# EAGLE design SNES_RGB_in_pass (EAGLE 7.5.0)
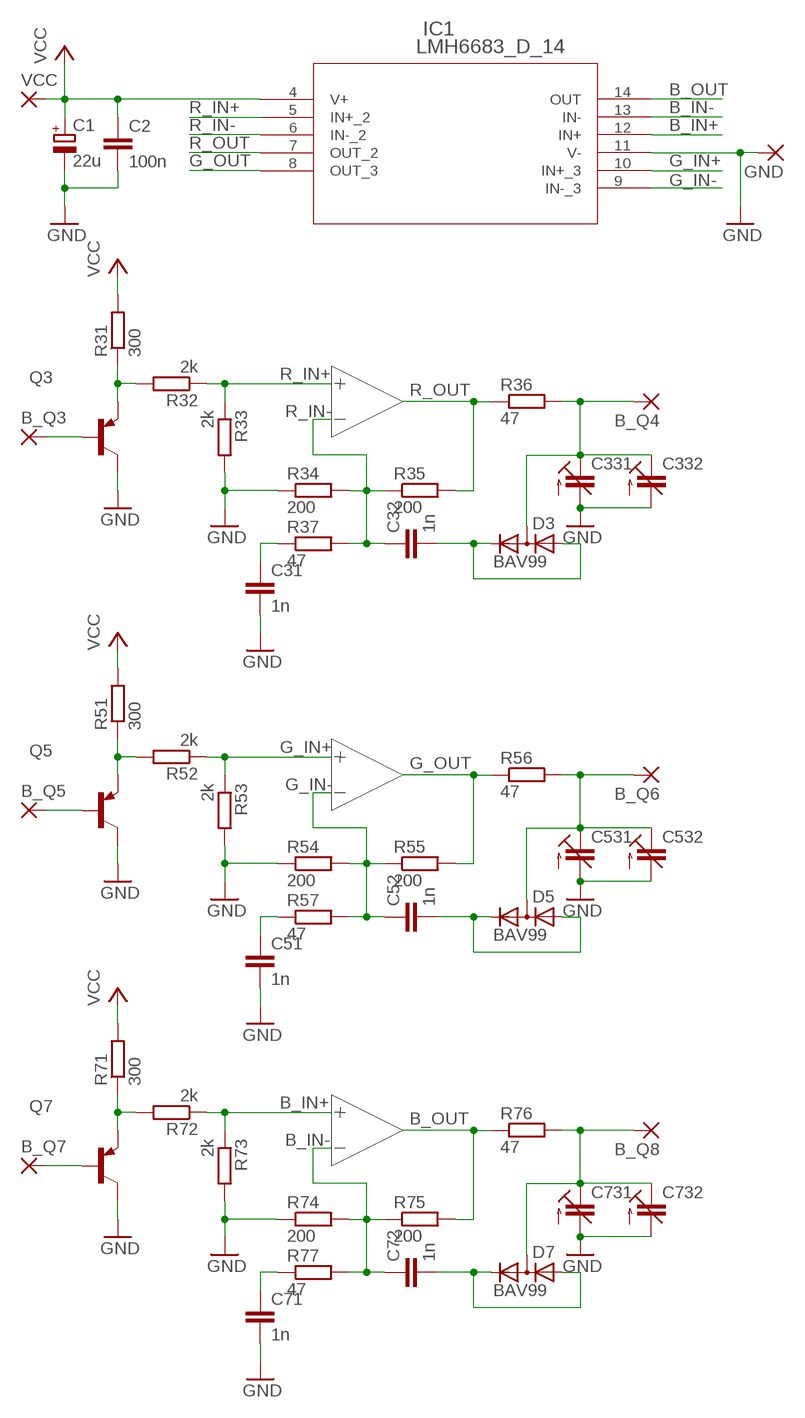
[diagram p0: schematic, sheet 1]

## Parts
B_Q3  SMD2  [SMD1,27-2,54]
B_Q4  SMD2  [SMD1,27-2,54]
B_Q5  SMD2  [SMD1,27-2,54]
B_Q6  SMD2  [SMD1,27-2,54]
B_Q7  SMD2  [SMD1,27-2,54]
B_Q8  SMD2  [SMD1,27-2,54]
C1  22u  CPOL-EUSMCC  [SMC_C]
C2  100n  C-EUC0805  [C0805]
C31  1n  C-EUC0805  [C0805]
C32  1n  C-EUC0805  [C0805]
C51  1n  C-EUC0805  [C0805]
C52  1n  C-EUC0805  [C0805]
C71  1n  C-EUC0805  [C0805]
C72  1n  C-EUC0805  [C0805]
C331  C-TRIMM3018_11  [CTRIM3018_11]
C332  C-TRIMMTZ03  [CTRIMTZ03]
C531  C-TRIMM3018_11  [CTRIM3018_11]
C532  C-TRIMMTZ03  [CTRIMTZ03]
C731  C-TRIMM3018_11  [CTRIM3018_11]
C732  C-TRIMMTZ03  [CTRIMTZ03]
D3  BAV99  BAV199  [SOT23]
D5  BAV99  BAV199  [SOT23]
D7  BAV99  BAV199  [SOT23]
GND  SMD5  [SMD2,54-5,08]
IC1  LMH6683_D_14  [M14A]
Q3  BC807-16-PNP-SOT23-BEC  [SOT23-BEC]
Q5  BC807-16-PNP-SOT23-BEC  [SOT23-BEC]
Q7  BC807-16-PNP-SOT23-BEC  [SOT23-BEC]
R31  300  R-EU_R0805  [R0805]
R32  2k  R-EU_R0805  [R0805]
R33  2k  R-EU_R0805  [R0805]
R34  200  R-EU_R0805  [R0805]
R35  200  R-EU_R0805  [R0805]
R36  47  R-EU_R0805  [R0805]
R37  47  R-EU_R0805  [R0805]
R51  300  R-EU_R0805  [R0805]
R52  2k  R-EU_R0805  [R0805]
R53  2k  R-EU_R0805  [R0805]
R54  200  R-EU_R0805  [R0805]
R55  200  R-EU_R0805  [R0805]
R56  47  R-EU_R0805  [R0805]
R57  47  R-EU_R0805  [R0805]
R71  300  R-EU_R0805  [R0805]
R72  2k  R-EU_R0805  [R0805]
R73  2k  R-EU_R0805  [R0805]
R74  200  R-EU_R0805  [R0805]
R75  200  R-EU_R0805  [R0805]
R76  47  R-EU_R0805  [R0805]
R77  47  R-EU_R0805  [R0805]
VCC  SMD5  [SMD2,54-5,08]

## Nets
B_IN+: IC1.12(IN+) R72.1 R73.1
B_IN-: C72.1 IC1.13(IN-) R74.2 R75.1 R77.2
B_OUT: IC1.14(OUT) R75.2 R76.1
G_IN+: IC1.10(IN+_3) R52.1 R53.1
G_IN-: C52.1 IC1.9(IN-_3) R54.2 R55.1 R57.2
G_OUT: IC1.8(OUT_3) R55.2 R56.1
GND: C1.- C2.2 C31.2 C51.2 C71.2 C331.-(A) C332.2(A) C531.-(A) C532.2(A) C731.-(A) C732.2(A) GND.1(P) IC1.11(V-) Q3.C Q5.C Q7.C R33.2 R34.1 R53.2 R54.1 R73.2 R74.1
N$1: C31.1 R37.1
N$2: C51.1 R57.1
N$3: B_Q3.1(P) Q3.B
N$4: B_Q4.1(P) C331.+(E) C332.1(E) D3.3(AC) R36.2
N$5: B_Q8.1(P) C731.+(E) C732.1(E) D7.3(AC) R76.2
N$6: Q3.E R31.1 R32.2
N$7: C32.2 D3.1(A) D3.2(C)
N$8: B_Q6.1(P) C531.+(E) C532.1(E) D5.3(AC) R56.2
N$9: B_Q5.1(P) Q5.B
N$11: Q5.E R51.1 R52.2
N$12: C52.2 D5.1(A) D5.2(C)
N$13: C71.1 R77.1
N$15: B_Q7.1(P) Q7.B
N$17: Q7.E R71.1 R72.2
N$18: C72.2 D7.1(A) D7.2(C)
R_IN+: IC1.5(IN+_2) R32.1 R33.1
R_IN-: C32.1 IC1.6(IN-_2) R34.2 R35.1 R37.2
R_OUT: IC1.7(OUT_2) R35.2 R36.1
VCC: C1.+ C2.1 IC1.4(V+) R31.2 R51.2 R71.2 VCC.1(P)

## Library data of the parts
B_Q3-B_Q8 = wirepad:SMD2: SMD PAD
C1 = rcl:CPOL-EU: POLARIZED CAPACITOR, European symbol
C2 C31 C32 C51 C52 C71 C72 = rcl:C-EU: CAPACITOR, European symbol
C331 C332 C531 C532 C731 C732 = rcl:C-TRIMM: Trimm capacitor
D3 D5 D7 = diode:BAV199: DIODE low-leakage double diode
GND VCC = wirepad:SMD5: SMD PAD
IC1 = lmh6683:LMH6683_D_14; COPYRIGHT: Copyright (C) 2015 Accelerated Designs. All rights reserved; MANUFACTURER_PART_NUMBER: LMH6683_D_14; VENDOR: National Semiconductor
Q3 Q5 Q7 = transistor:*-PNP-: PNP Transistror
R31-R37 R51-R57 R71-R77 = rcl:R-EU_: RESISTOR, European symbol

## Board
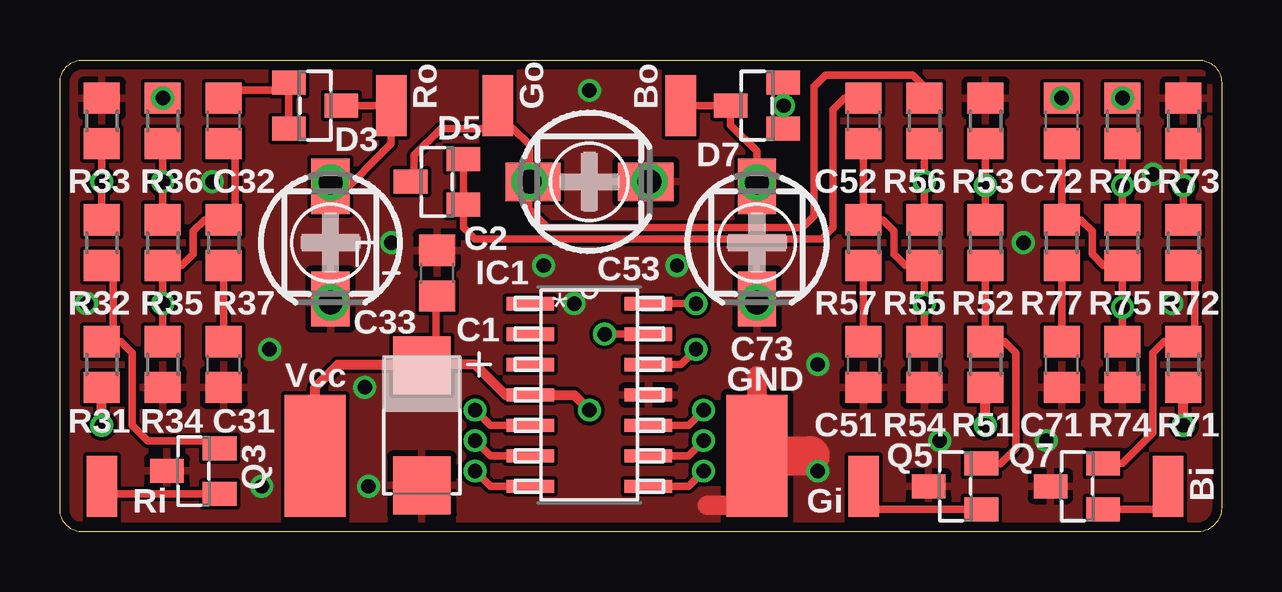
[diagram p1: board, top side]
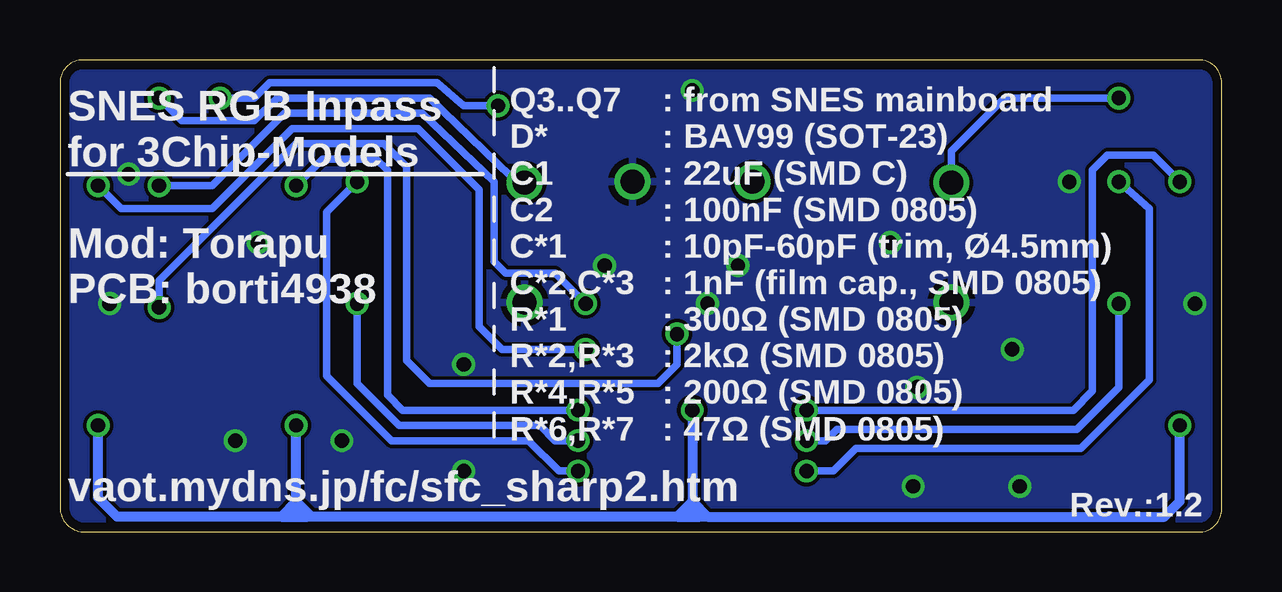
[diagram p2: board, bottom side, seen from below]

Size 48.42 x 19.68 mm. Coordinates in mm from the lower left corner, seen from the top.
Outline: 0.95,0 arc-90 0,0.95 0,18.73 arc-90 0.95,19.68 47.47,19.68 arc-90 48.42,18.73 48.42,1.11 arc-90 47.47,0 0.95,0
Copper layers (1*16): Top 0.0356mm / dielectric 1.5011mm / Bottom 0.0356mm
Design rules "LaenPCBOrder": minimum track width 6mil, minimum drill 13mil, track to track 6mil, track to pad 6mil, pad to pad 6mil, via to via 6mil, smd to smd 6mil, copper to edge 15mil, drill to drill 6mil, minimum pad ring 7mil, minimum via ring 7mil, stop-mask expansion 3mil, vias tented up to drill 30mil, thermal gap 10mil
tRestrict: area 27.8,0.5 to 30.3,0.8; area 27,2.1 to 27.8,4.3

### Footprints (pad centres in the part's own frame; a part is rotated, then mirrored left to right if it is on the bottom)
SMD1,27-2,54 = smd 1.27 x 2.54: 1 0,0
SMC_C = smd 2.4 x 2.4: + -2.5,0; - 2.5,0
C0805 = smd 1.3 x 1.5: 1 -0.95,0; 2 0.95,0
CTRIM3018_11 = smd 2.3 x 1.6: + -2.35,0; - 2.35,0
CTRIMTZ03 = drill 1: 1 0,2.5; 2 0,-2.5
SOT23 = smd 1 x 1.4: 1 -0.95,-1.1; 2 0.95,-1.1; 3 0,1.1
SMD2,54-5,08 = smd 2.54 x 5.08: 1 0,0
M14A = smd 1.981 x 0.559: 1 -2.464,3.81; 2 -2.464,2.54; 3 -2.464,1.27; 4 -2.464,0; 5 -2.464,-1.27; 6 -2.464,-2.54; 7 -2.464,-3.81; 8 2.464,-3.81; 9 2.464,-2.54; 10 2.464,-1.27; 11 2.464,0; 12 2.464,1.27; 13 2.464,2.54; 14 2.464,3.81
SOT23-BEC = smd 1 x 1.4: B -0.95,-1.1; C 0,1.1; E 0.95,-1.1
R0805 = smd 1.3 x 1.5: 1 -0.95,0; 2 0.95,0

### Placement (x,y rotation side)
B_Q3  1.75,1.91 180 top
B_Q4  13.81,17.78 0 top
B_Q5  33.5,1.91 0 top
B_Q6  18.26,17.78 0 top
B_Q7  46.2,1.91 0 top
B_Q8  25.88,17.78 180 top
C1  15.08,4.45 270 top
C2  15.72,10.79 90 top
C31  6.83,6.99 270 top
C32  6.83,17.14 90 top
C51  33.5,6.99 270 top
C52  33.5,17.14 90 top
C71  41.75,6.99 270 top
C72  41.75,17.14 90 top
C331  11.27,12.06 270 top
C332  11.27,12.06 0 top
C531  22.07,14.61 0 top
C532  22.07,14.61 90 top
C731  29.05,12.06 270 top
C732  29.05,12.06 0 top
D3  10.64,17.78 270 top
D5  15.72,14.61 90 top
D7  29.05,17.78 90 top
GND  29.05,3.17 180 top
IC1  22.07,5.71 0 top
Q3  5.56,2.54 90 top
Q5  37.31,1.91 90 top
Q7  42.39,1.91 90 top
R31  1.75,6.99 270 top
R32  1.75,12.06 270 top
R33  1.75,17.14 90 top
R34  4.29,6.99 90 top
R35  4.29,12.06 90 top
R36  4.29,17.14 90 top
R37  6.83,12.06 90 top
R51  38.58,6.99 270 top
R52  38.58,12.06 270 top
R53  38.58,17.14 90 top
R54  36.04,6.99 90 top
R55  36.04,12.06 90 top
R56  36.04,17.14 90 top
R57  33.5,12.06 90 top
R71  46.83,6.99 270 top
R72  46.83,12.06 270 top
R73  46.83,17.14 90 top
R74  44.29,6.99 90 top
R75  44.29,12.06 90 top
R76  44.29,17.14 90 top
R77  41.75,12.06 90 top
VCC  10.64,3.17 0 top

### Tracks (layer width: path | path; a pad name or v marks a point on that pad's centre or on a via)
B_IN+  (via drill 0.6)
  Top 0.305: R73.1 v46.83,14.45 R72.1 | IC1.12 25.88,6.99 v26.51,7.62
  Bottom 0.305: v46.83,14.45 45.88,13.49 42.07,13.49 38.74,16.83 33.5,16.83 30.96,14.29 30.96,8.57 30,7.62 v26.51,7.62
B_IN-  (via drill 0.6)
  Top 0.305: R74.2 v44.29,9.37 R75.1 43.5,11.12 43.02,11.59 43.02,12.54 42.55,13.02 R77.2 C72.1 | IC1.13 v22.7,8.26
  Bottom 0.305: v22.7,8.26 22.7,6.99 23.5,6.19 33.02,6.19 33.97,7.14 33.97,15.24 34.93,16.19 38.58,16.19 44.29,10.48 v44.29,9.37
B_OUT  (via drill 0.6)
  Top 0.305: R76.1 v44.29,14.45 R75.2 | IC1.14 v26.51,9.53
  Bottom 0.305: v26.51,9.53 27.78,10.79 29.85,10.79 30.32,11.27 30.32,14.61 33.34,17.46 39.05,17.46 42.07,14.45 v44.29,14.45
G_IN+  (via drill 0.6)
  Top 0.305: R53.1 v38.58,14.45 R52.1 | IC1.10 26.19,4.45 v26.83,5.08
  Bottom 0.305: v26.83,5.08 34.13,5.08 34.77,5.71 34.77,15.08 35.24,15.56 37.47,15.56 v38.58,14.45
G_IN-  (via drill 0.6)
  Top 0.305: R54.2 v36.04,9.53 R55.1 35.24,11.11 34.77,11.59 34.77,12.54 34.29,13.02 R57.2 C52.1 | IC1.9 26.19,3.17 v26.83,3.81
  Bottom 0.305: v26.83,3.81 27.78,3.81 28.42,4.45 34.29,4.45 36.04,6.19 v36.04,9.53
G_OUT  (via drill 0.6)
  Top 0.305: R55.2 v36.04,14.61 R56.1 | IC1.8 26.19,1.91 v26.83,2.54
  Bottom 0.305: v36.04,14.61 37.31,13.34 37.31,6.51 34.61,3.81 28.89,3.81 27.62,2.54 v26.83,2.54
GND  (via drill 0.6)
  Top 0.813: 29.05,6.51 GND.1 29.05,1.11 26.99,1.11
  Top 1.626: GND.1 31.27,3.17
  other vias: 31.59,6.99 6.35,14.61 21.43,9.53 25.72,11.11 31.59,2.54 22.07,18.41 45.56,14.92 1.11,9.53 46.36,9.53 40.16,12.06 13.81,12.06 12.86,1.91 41.12,3.81 36.67,3.81 20.16,11.11 12.7,6.03 8.41,1.91 8.73,7.62
  pour Bottom: -0.16,-0.64 49.37,-0.64 49.37,19.68 -0.16,19.68
  pour Top: -0.16,-0.64 49.37,-0.64 49.37,19.68 -0.16,19.68
N$1
  Top 0.305: R37.1 C31.1
N$2
  Top 0.305: R57.1 C51.1
N$3
  Top 0.305: B_Q3.1 1.75,1.75 1.91,1.59 Q3.B
N$4  (via drill 0.6)
  Top 0.305: R36.2 | 11.59,17.93 D3.3 | D3.3 11.59,17.78 | D3.3 B_Q4.1 13.81,16.19 11.55,13.93 C332.1 C331.+
  Bottom 0.305: R36.2 9.05,18.1 11.27,15.88 C332.1
  other vias: 4.29,18.1
N$5  (via drill 0.6)
  Top 0.305: R76.2 | D7.3 | D7.3 27.95,16.97 29.05,15.88 C732.1 | B_Q8.1 D7.3
  Top 0.406: C731.+ C732.1
  Bottom 0.305: C732.1 29.05,14.29 33.02,18.1 39.37,18.1 40.32,17.14 43.34,17.14 43.82,17.62 | 43.82,17.62 | 43.82,17.62 R76.2
  other vias: 44.29,18.1
N$6
  Top 0.305: Q3.E 6.66,3.8 6.67,3.81 3.65,3.81 3.02,4.45 3.02,7.46 2.54,7.94 R31.1 2.22,8.41 2.22,11.11 2.06,11.11 2.06,11.12 R32.2
N$7
  Top 0.305: D3.2 D3.1 9.22,18.41 6.83,18.41 C32.2
N$8
  Top 0.305: B_Q6.1 18.26,16.83 | 18.26,16.83 15.88,16.83 14.76,15.72 14.76,14.75 D5.3 | C532.1 19.57,16.15 18.89,16.83 18.26,16.83 | R56.2 36.04,18.57 35.56,19.05 31.91,19.05 31.43,18.57 31.43,13.18 30.96,12.7 20.32,12.7 19.53,13.49 19.53,14.61 C531.+
  Top 0.406: C531.+ C532.1
N$9
  Top 0.305: Q5.B 33.5,0.96 33.5,0.95 B_Q5.1
N$11
  Top 0.305: R52.2 R51.1 39.37,7.94 39.85,7.46 39.85,3.49 39.2,2.85 Q5.E
N$12
  Top 0.305: C52.2 32.7,18.1 32.23,17.62 32.23,12.7 31.75,12.22 17.3,12.22 16.83,12.7 16.83,13.49 16.82,13.51 D5.1 D5.2
N$13
  Top 0.305: R77.1 C71.1
N$15
  Top 0.305: Q7.B 46.19,0.96 46.2,0.95 B_Q7.1
N$17
  Top 0.305: Q7.E 44.29,2.86 45.56,4.13 45.56,7.46 46.04,7.94 R71.1 47.31,8.41 47.31,11.11 47.31,11.12 R72.2
N$18  (via drill 0.6)
  Top 0.305: D7.2 30.15,18.1 | 30.15,18.1 D7.1 | C72.2 | v30.16,17.78 30.15,18.1
  Bottom 0.305: v30.16,17.78 31.59,17.78 32.7,18.73 39.69,18.73 40.32,18.1 C72.2
  other vias: 41.75,18.1
R_IN+  (via drill 0.6)
  Top 0.305: R32.1 v1.75,14.61 R33.1 | IC1.5 17.94,4.45 v17.3,5.08
  Bottom 0.305: v1.75,14.61 2.86,15.72 4.76,15.72 5.4,15.08 5.4,5.87 6.19,5.08 v17.3,5.08
R_IN-  (via drill 0.6)
  Top 0.305: R34.2 v4.29,9.53 R35.1 5.08,11.11 5.56,11.59 5.56,12.54 6.03,13.02 R37.2 7.3,13.02 7.3,16.19 C32.1 | IC1.6 17.94,3.17 v17.3,3.81
  Bottom 0.305: v4.29,9.53 4.29,6.03 6.03,4.29 16.03,4.29 16.51,3.81 v17.3,3.81
R_OUT  (via drill 0.6)
  Top 0.305: R35.2 v4.29,14.61 R36.1 | IC1.7 17.94,1.91 v17.3,2.54
  Bottom 0.305: v4.29,14.61 3.02,13.49 3.02,6.35 5.87,3.49 15.24,3.49 16.19,2.54 v17.3,2.54
VCC  (via drill 0.6)
  Top 0.305: 15.68,7.74 15.68,9.8 C2.1
  Top 0.406: C1.+ 15.04,7.62 15.68,7.74 | VCC.1 10.64,6.03 11.59,6.99 15.04,6.99 C1.+ | C1.+ 15.12,6.99 17.3,6.99 18.57,5.71 IC1.4 21.43,5.71 v22.07,5.08 | v46.83,4.45 R71.2 | v38.58,4.45 R51.2 | v1.75,4.45 R31.2
  Bottom 0.406: v22.07,5.08 22.07,1.27 | 37.94,0.64 38.58,1.27 | 38.58,1.27 39.21,0.64 | 39.21,0.64 39.05,0.64 | 39.05,0.64 38.1,0.64 | 37.94,0.64 38.1,0.64 | 38.1,0.64 38.58,1.11 39.05,0.64 | 39.21,0.64 46.04,0.64 46.83,1.43 v46.83,4.45 | 38.58,1.27 v38.58,4.45 | 22.07,1.27 21.43,0.64 | 21.43,0.64 2.38,0.64 1.75,1.27 v1.75,4.45 | 22.7,0.64 21.75,0.64 | 21.43,0.64 21.75,0.64 | 21.75,0.64 22.23,1.11 | 22.23,1.11 22.07,1.27 | 22.23,1.11 22.7,0.64 | 22.7,0.64 37.94,0.64

### Text on the board
bPlace: Rev.:1.2
tNames: Ro | Go | Bo | D3 | D5 | D7 | R33 | R36 | C32 | C52 | R56 | R53 | C72 | R76 | R73 | C2 | IC1 | C53 | R32 | R35 | R37 | R57 | R55 | R52 | R77 | R75 | R72 | C33 | C1 | C73 | Vcc | GND | R31 | R34 | C31 | C51 | R54 | R51 | C71 | R74 | R71 | Q5 | Q7 | Q3 | Bi | Ri | Gi
bNames: SNES RGB Inpass / for 3Chip-Models / / Mod: Torapu / PCB: borti4938 | : from SNES mainboard / : BAV99 (SOT-23) / : 22uF (SMD C) / : 100nF (SMD 0805) / : 10pF-60pF (trim, Ø4.5mm) / : 1nF (film cap., SMD 0805) / : 300Ω (SMD 0805) / : 2kΩ (SMD 0805) / : 200Ω (SMD 0805) / : 47Ω (SMD 0805) | Q3..Q7 / D* / C1 / C2 / C*1 / C*2,C*3 / R*1 / R*2,R*3 / R*4,R*5 / R*6,R*7 | vaot.mydns.jp/fc/sfc_sharp2.htm